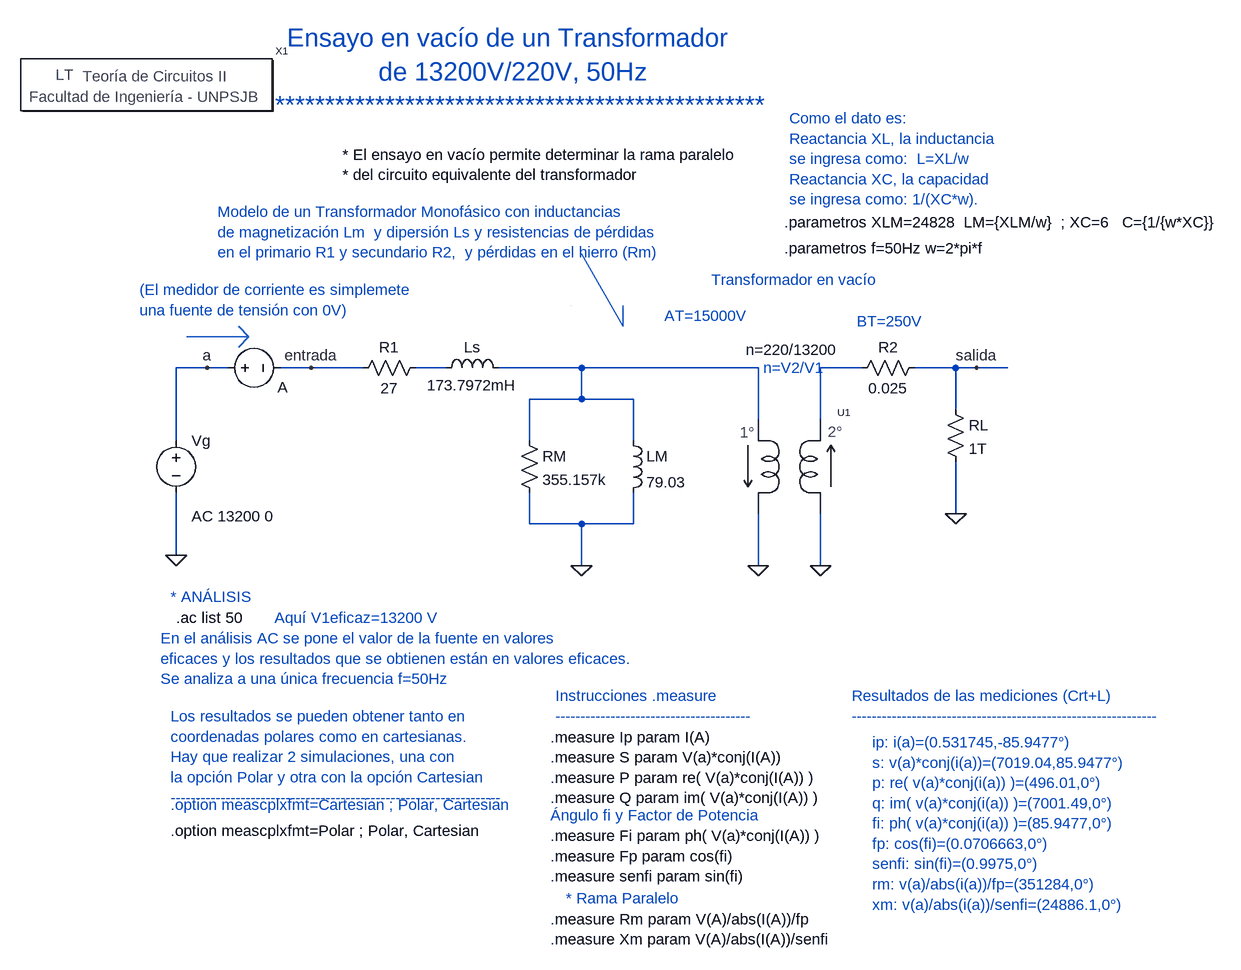
[diagram p0: schematic Ensayo de circuito abierto Transformador con perdidas.asc]
Ensayo de circuito abierto Transformador con perdidas.asc, the LTspice schematic file:
Version 4
SHEET 1 2740 2064
WIRE 16 208 -32 208
WIRE 48 208 16 208
WIRE 176 208 128 208
WIRE 256 208 176 208
WIRE 384 208 336 208
WIRE 592 208 464 208
WIRE 864 208 592 208
WIRE 1024 208 960 208
WIRE 1168 208 1104 208
WIRE 1200 208 1168 208
WIRE 1248 208 1200 208
WIRE 592 256 592 208
WIRE 592 256 512 256
WIRE 672 256 592 256
WIRE 1168 272 1168 208
WIRE 864 288 864 208
WIRE 960 288 960 208
WIRE -32 320 -32 208
WIRE 512 320 512 256
WIRE 672 320 672 256
WIRE 1168 432 1168 352
WIRE 512 448 512 400
WIRE 592 448 512 448
WIRE 672 448 672 400
WIRE 672 448 592 448
WIRE -32 496 -32 400
WIRE 592 512 592 448
WIRE 864 512 864 432
WIRE 960 512 960 432
FLAG -32 496 0
FLAG 864 512 0
FLAG 960 512 0
FLAG 1200 208 salida
FLAG 1168 432 0
FLAG 592 512 0
FLAG 176 208 entrada
FLAG 16 208 a
SYMBOL voltage -32 304 R0
WINDOW 123 24 132 Left 2
WINDOW 39 0 0 Left 2
SYMATTR Value2 AC 13200 0
SYMATTR InstName Vg
SYMATTR Value ""
SYMBOL res 1152 256 R0
SYMATTR InstName RL
SYMATTR Value 1T
SYMBOL res 496 304 R0
SYMATTR InstName RM
SYMATTR Value 355.157k
SYMBOL res 352 192 R90
WINDOW 0 0 56 VBottom 2
WINDOW 3 32 56 VTop 2
SYMATTR InstName R1
SYMATTR Value 27
SYMBOL res 1120 192 R90
WINDOW 0 0 56 VBottom 2
WINDOW 3 32 56 VTop 2
SYMATTR InstName R2
SYMATTR Value 0.025
SYMBOL ind 368 224 R270
WINDOW 0 32 56 VTop 2
WINDOW 3 5 56 VBottom 2
SYMATTR InstName Ls
SYMATTR Value 173.7972mH
SYMBOL ind 656 304 R0
SYMATTR InstName LM
SYMATTR Value 79.03
SYMBOL voltage 32 208 R270
WINDOW 0 -30 92 VRight 2
WINDOW 3 -10 50 Invisible 2
SYMATTR InstName A
SYMATTR Value 0
SYMBOL trafoi 912 352 R0
WINDOW 39 4 -172 Center 2
SYMATTR SpiceLine n=220/13200
SYMATTR InstName U1
SYMBOL Circuitos2\\Letreros\\Teoría\ de\ Circuitos\ II -80 -224 R0
SYMATTR InstName X1
TEXT 32 -32 Left 2 ;Modelo de un Transformador Monofásico con inductancias\nde magnetización Lm  y dipersión Ls y resistencias de pérdidas\nen el primario R1 y secundario R2,  y pérdidas en el hierro (Rm)
TEXT -32 592 Left 2 !.ac list 50
TEXT -56 624 Left 2 ;En el análisis AC se pone el valor de la fuente en valores\neficaces y los resultados que se obtienen están en valores eficaces.\nSe analiza a una única frecuencia f=50Hz
TEXT 120 592 Left 2 ;Aquí V1eficaz=13200 V
TEXT 792 72 Left 2 ;Transformador en vacío
TEXT 488 -248 Center 4 ;Ensayo en vacío de un Transformador \nde 13200V/220V, 50Hz\n*************************************************
TEXT -40 744 Left 2 ;Los resultados se pueden obtener tanto en\ncoordenadas polares como en cartesianas.\nHay que realizar 2 simulaciones, una con\nla opción Polar y otra con la opción Cartesian\n------------------------------------------------------------------
TEXT -40 880 Left 2 ;.option meascplxfmt=Cartesian ; Polar, Cartesian
TEXT -40 920 Left 2 !.option meascplxfmt=Polar ; Polar, Cartesian
TEXT 544 776 Left 2 !.measure Ip param I(A)\n.measure S param V(a)*conj(I(A))\n.measure P param re( V(a)*conj(I(A)) )\n.measure Q param im( V(a)*conj(I(A)) )
TEXT 544 928 Left 2 !.measure Fi param ph( V(a)*conj(I(A)) )\n.measure Fp param cos(fi)\n.measure senfi param sin(fi)
TEXT 544 896 Left 2 ;Ángulo fi y Factor de Potencia
TEXT 552 712 Left 2 ;Instrucciones .measure \n---------------------------------------
TEXT -88 88 Left 2 ;(El medidor de corriente es simplemete\nuna fuente de tensión con 0V)
TEXT 1008 712 Left 2 ;Resultados de las mediciones (Crt+L)\n-------------------------------------------------------------
TEXT 872 208 Left 2 ;n=V2/V1
TEXT -40 560 Left 2 ;* ANÁLISIS
TEXT 904 -16 Left 2 !.parametros XLM=24828  LM={XLM/w}  ; XC=6   C={1/{w*XC}}
TEXT 912 -176 Left 2 ;Como el dato es:\nReactancia XL, la inductancia\nse ingresa como:  L=XL/w\nReactancia XC, la capacidad\nse ingresa como: 1/(XC*w).
TEXT 904 24 Left 2 !.parametros f=50Hz w=2*pi*f
TEXT 1040 784 Left 2 ;ip: i(a)=(0.531745,-85.9477°)\ns: v(a)*conj(i(a))=(7019.04,85.9477°)\np: re( v(a)*conj(i(a)) )=(496.01,0°)\nq: im( v(a)*conj(i(a)) )=(7001.49,0°)\nfi: ph( v(a)*conj(i(a)) )=(85.9477,0°)\nfp: cos(fi)=(0.0706663,0°)\nsenfi: sin(fi)=(0.9975,0°)\nrm: v(a)/abs(i(a))/fp=(351284,0°)\nxm: v(a)/abs(i(a))/senfi=(24886.1,0°)
TEXT 720 128 Left 2 ;AT=15000V
TEXT 1016 136 Left 2 ;BT=250V
TEXT 224 -120 Left 2 !* El ensayo en vacío permite determinar la rama paralelo\n* del circuito equivalente del transformador
TEXT 544 1056 Left 2 !.measure Rm param V(A)/abs(I(A))/fp\n.measure Xm param V(A)/abs(I(A))/senfi
TEXT 568 1024 Left 2 ;* Rama Paralelo
LINE Normal 80 160 -16 160
LINE Normal 64 144 80 160
LINE Normal 64 176 80 160
LINE Normal 576 112 576 112 2
LINE Normal 576 112 576 112 2
LINE Normal 576 112 576 112 2
LINE Normal 656 144 592 32
LINE Normal 656 112 656 144

The netlist it stands for:
* Ensayo de circuito abierto Transformador con perdidas.asc
Vg a 0 AC 13200 0
RL salida 0 1T
RM N002 0 355.157k
R1 N001 entrada 27
R2 salida N003 0.025
Ls N001 N002 173.7972mH
LM N002 0 79.03
V§A a entrada 0
XU1 N002 0 N003 0 TFI TFI n=220/13200  ; pins 1 2 3 4
XX1 Teoría de Circuitos II
* Modelo de un Transformador Monofásico con inductancias
* de magnetización Lm  y dipersión Ls y resistencias de pérdidas
* en el primario R1 y secundario R2,  y pérdidas en el hierro (Rm)
.ac list 50
* En el análisis AC se pone el valor de la fuente en valores
* eficaces y los resultados que se obtienen están en valores eficaces.
* Se analiza a una única frecuencia f=50Hz
* Aquí V1eficaz=13200 V
* Transformador en vacío
* Ensayo en vacío de un Transformador
* de 13200V/220V, 50Hz
* *************************************************
* Los resultados se pueden obtener tanto en
* coordenadas polares como en cartesianas.
* Hay que realizar 2 simulaciones, una con
* la opción Polar y otra con la opción Cartesian
* ------------------------------------------------------------------
* .option meascplxfmt=Cartesian ; Polar, Cartesian
.option meascplxfmt=Polar ; Polar, Cartesian
.measure Ip param I(A)
.measure S param V(a)*conj(I(A))
.measure P param re( V(a)*conj(I(A)) )
.measure Q param im( V(a)*conj(I(A)) )
.measure Fi param ph( V(a)*conj(I(A)) )
.measure Fp param cos(fi)
.measure senfi param sin(fi)
* Ángulo fi y Factor de Potencia
* Instrucciones .measure
* ---------------------------------------
* (El medidor de corriente es simplemete
* una fuente de tensión con 0V)
* Resultados de las mediciones (Crt+L)
* -------------------------------------------------------------
* n=V2/V1
* * ANÁLISIS
.parametros XLM=24828  LM={XLM/w}  ; XC=6   C={1/{w*XC}}
* Como el dato es:
* Reactancia XL, la inductancia
* se ingresa como:  L=XL/w
* Reactancia XC, la capacidad
* se ingresa como: 1/(XC*w).
.parametros f=50Hz w=2*pi*f
* ip: i(a)=(0.531745,-85.9477°)
* s: v(a)*conj(i(a))=(7019.04,85.9477°)
* p: re( v(a)*conj(i(a)) )=(496.01,0°)
* q: im( v(a)*conj(i(a)) )=(7001.49,0°)
* fi: ph( v(a)*conj(i(a)) )=(85.9477,0°)
* fp: cos(fi)=(0.0706663,0°)
* senfi: sin(fi)=(0.9975,0°)
* rm: v(a)/abs(i(a))/fp=(351284,0°)
* xm: v(a)/abs(i(a))/senfi=(24886.1,0°)
* AT=15000V
* BT=250V
* El ensayo en vacío permite determinar la rama paralelo
* del circuito equivalente del transformador
.measure Rm param V(A)/abs(I(A))/fp
.measure Xm param V(A)/abs(I(A))/senfi
* * Rama Paralelo
.lib ..\sym\Circuitos2\Transformadores\trafosideales.lib
.backanno
.end